# EAGLE design eload_powermeter (EAGLE 9.1.1)
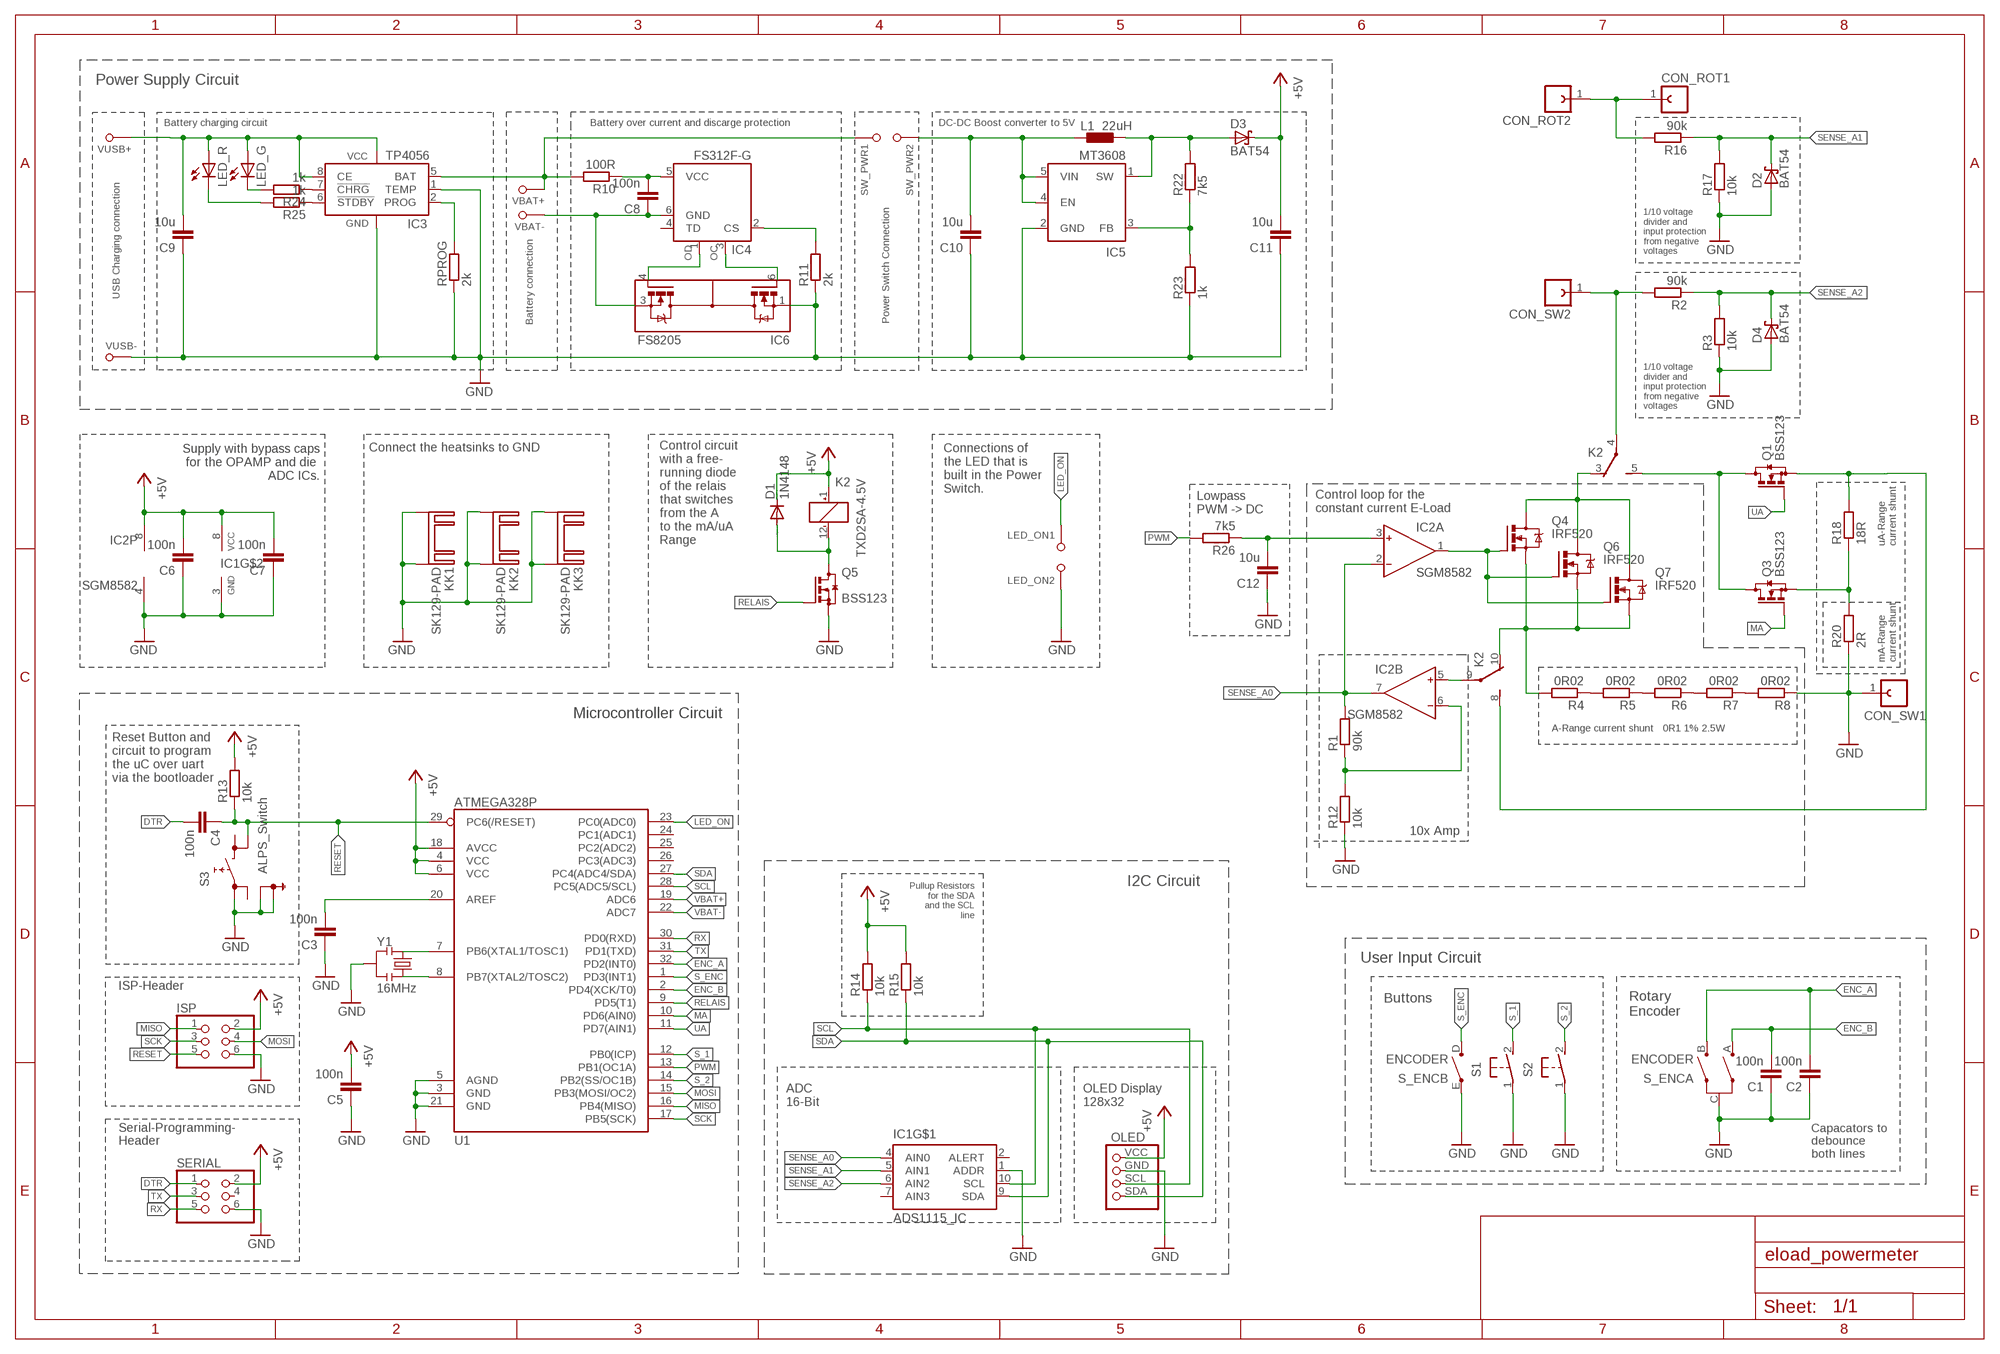
[diagram p0: schematic, sheet 1]

## Parts
C1  100n  C-EUC0603  [C0603]
C2  100n  C-EUC0603  [C0603]
C3  100n  C-EUC0603  [C0603]
C4  100n  C-EUC0603  [C0603]
C5  100n  C-EUC0603  [C0603]
C6  100n  C-EUC0603  [C0603]
C7  100n  C-EUC0603  [C0603]
C8  100n  C-EUC0603  [C0603]
C9  10u  C-EUC0603  [C0603]
C10  10u  C-EUC0603  [C0603]
C11  10u  C-EUC0603  [C0603]
C12  10u  C-EUC0603  [C0603]
CON_ROT1  BANANEN_BUCHSE  [BANANENBUCHSE]
CON_ROT2  BANANEN_BUCHSE  [BANANENBUCHSE]
CON_SW1  BANANEN_BUCHSE  [BANANENBUCHSE]
CON_SW2  BANANEN_BUCHSE  [BANANENBUCHSE]
D1  1N4148  MBR0520LT  [SOD123]
D2  BAT54  [SOT23]
D3  BAT54  [SOT23]
D4  BAT54  [SOT23]
IC1  ADS1115_IC  [MSOP10]
IC2  SGM8582  AD826R  [SO8]
IC3  TP4056  [SOP08]
IC4  FS312F-G  [SOT23-6]
IC5  MT3608  [SOT23-6]
IC6  FS8205  [SOT23-6]
ISP  PINHD-2X3_SMD  [2X03]
K2  TXD2SA-4.5V  [TXD2SA]
KK1  SK129-PAD  [SK129]
KK2  SK129-PAD  [SK129]
KK3  SK129-PAD  [SK129]
L1  22uH  L_1210  [R1210]
LED_G  LED_REVERSE_MOUNTSMT1206_REVERSE  [1206_LED_REVERSE_MOUNT]
LED_ON1  SOLDER_PAD  [SOLDER_PAD]
LED_ON2  SOLDER_PAD  [SOLDER_PAD]
LED_R  LED_REVERSE_MOUNTSMT1206_REVERSE  [1206_LED_REVERSE_MOUNT]
OLED  OLED_128X32  [1X04_OLED]
Q1  BSS123  [SOT23]
Q3  BSS123  [SOT23]
Q4  IRF520  [TO220BV]
Q5  BSS123  [SOT23]
Q6  IRF520  [TO220BV]
Q7  IRF520  [TO220BV]
R1  90k  R-EU_R0603  [R0603]
R2  90k  R-EU_R0603  [R0603]
R3  10k  R-EU_R0603  [R0603]
R4  0R02  R-EU_R1206  [R1206]
R5  0R02  R-EU_R1206  [R1206]
R6  0R02  R-EU_R1206  [R1206]
R7  0R02  R-EU_R1206  [R1206]
R8  0R02  R-EU_R1206  [R1206]
R10  100R  R-EU_R0603  [R0603]
R11  2k  R-EU_R0603  [R0603]
R12  10k  R-EU_R0603  [R0603]
R13  10k  R-EU_R0603  [R0603]
R14  10k  R-EU_R0603  [R0603]
R15  10k  R-EU_R0603  [R0603]
R16  90k  R-EU_R0603  [R0603]
R17  10k  R-EU_R0603  [R0603]
R18  18R  R-EU_R0603  [R0603]
R20  2R  R-EU_R0603  [R0603]
R22  7k5  R-EU_R0603  [R0603]
R23  1k  R-EU_R0603  [R0603]
R24  1k  R-EU_R0603  [R0603]
R25  1k  R-EU_R0603  [R0603]
R26  7k5  R-EU_R0603  [R0603]
RPROG  2k  R-EU_R0603  [R0603]
S1  PUSH_BUTTON_ALPS  [B3F-31XX]
S2  PUSH_BUTTON_ALPS  [B3F-31XX]
S3  ALPS_Switch  ALPS_SKSGPAE010S  [SKHMPXE010]
S_ENC  ENCODER  [CI-11]
SERIAL  PINHD-2X3_SMD  [2X03]
SW_PWR1  SOLDER_PAD  [SOLDER_PAD]
SW_PWR2  SOLDER_PAD  [SOLDER_PAD]
U1  ATMEGA328P  [TQFP32-08]
VBAT+  SOLDER_PAD  [SOLDER_PAD]
VBAT-  SOLDER_PAD  [SOLDER_PAD]
VUSB+  SOLDER_PAD  [SOLDER_PAD]
VUSB-  SOLDER_PAD  [SOLDER_PAD]
Y1  16MHz  RESONATOR1:1  [RESONATOR-SMD-1:1]

## Nets
+5V: C5.2 C6.2 C7.2 C11.2 D1.C D3.3(C) IC1.8(VCC) IC2.8(P:V+) ISP.2 K2.1(_:+) OLED.VCC(VDD) R13.2 R14.2 R15.2 SERIAL.2 U1.4(VCC) U1.6(VCC) U1.18(AVCC)
DTR: C4.2 SERIAL.1
ENC_A: C2.2 S_ENC.B(A:B) U1.32(PD2(INT0))
ENC_B: C1.2 S_ENC.A(A:A) U1.2(PD4(XCK/T0))
GND: C1.1 C2.1 C3.1 C5.1 C6.1 C7.1 C9.1 C10.1 C11.1 C12.1 CON_SW1.1 D2.1(A) D4.1(A) IC1.1(ADDR) IC1.3(GND) IC2.4(P:V-) IC3.1(TEMP) IC3.3(GND) IC5.2(GND) IC6.1(S1) ISP.6 KK1.A2,5(K) KK1.B2,5(K) KK2.A2,5(K) KK2.B2,5(K) KK3.A2,5(K) KK3.B2,5(K) LED_ON2.P$1 OLED.GND Q5.2(S) R3.1 R8.1 R11.1 R12.1 R17.1 R20.1 R23.1 RPROG.1 S1.1(P) S2.1(P) S3.1(3.1) S3.5(SH1) S3.6(SH2) S_ENC.C(A:C) S_ENC.E(B:E) SERIAL.6 U1.3(GND) U1.5(AGND) U1.21(GND) VUSB-.P$1 Y1.2
LED_ON: LED_ON1.P$1 U1.23(PC0(ADC0))
MA: Q3.1(G) U1.10(PD6(AIN0))
MISO: ISP.1 U1.16(PB4(MISO))
MOSI: ISP.4 U1.15(PB3(MOSI/OC2))
N$1: CON_ROT1.1 CON_ROT2.1 R16.2
N$2: IC2.1(A:OUT) Q4.G Q6.G Q7.G
N$3: Q3.2(S) R18.1 R20.2
N$5: K2.5(S) Q1.3(D) Q3.3(D)
N$6: R4.1 R5.2
N$7: K2.10(O) Q4.S Q6.S Q7.S R4.2
N$8: C12.2 IC2.3(A:IN+) R26.1
N$9: K2.3(O) Q4.D Q6.D Q7.D
N$10: D1.A K2.12(_:-) Q5.3(D)
N$11: R5.1 R6.2
N$12: U1.7(PB6(XTAL1/TOSC1)) Y1.1
N$13: IC2.5(B:IN+) K2.9(P)
N$14: CON_SW2.1 K2.4(P) R2.2
N$15: U1.8(PB7(XTAL2/TOSC2)) Y1.3
N$16: C8.2 IC4.5(VCC) R10.1
N$17: R6.1 R7.2
N$18: R7.1 R8.2
N$19: D3.1(A) IC5.1(SW) L1.2 R22.2
N$20: IC4.1(OD) IC6.4(G2)
N$21: IC3.2(PROG) RPROG.2
N$22: IC4.3(OC) IC6.6(G1)
N$23: C10.2 IC5.4(EN) IC5.5(VIN) L1.1 SW_PWR2.P$1
N$24: IC4.2(CS) R11.2
N$25: IC5.3(FB) R22.1 R23.2
N$27: IC3.7(!CHRG) R24.1
N$28: IC3.6(!STDBY) R25.1
N$29: LED_G.C R24.2
N$30: LED_R.C R25.2
N$31: C3.2 U1.20(AREF)
N$33: IC2.6(B:IN-) R1.1 R12.2
N$40: K2.8(S) Q1.2(S) R18.2
PWM: R26.2 U1.13(PB1(OC1A))
RELAIS: Q5.1(G) U1.9(PD5(T1))
RESET: C4.1 ISP.5 R13.1 S3.4(4.2) U1.29(PC6(/RESET))
RX: SERIAL.5 U1.30(PD0(RXD))
S_1: S1.2(S) U1.12(PB0(ICP))
S_2: S2.2(S) U1.14(PB2(SS/OC1B))
S_ENC: S_ENC.D(B:D) U1.1(PD3(INT1))
SCK: ISP.3 U1.17(PB5(SCK))
SCL: IC1.10(SCL) OLED.SCL R14.1 U1.28(PC5(ADC5/SCL))
SDA: IC1.9(SDA) OLED.SDA R15.1 U1.27(PC4(ADC4/SDA))
SENSE_A0: IC1.4(AIN0) IC2.2(A:IN-) IC2.7(B:OUT) R1.2
SENSE_A1: D2.3(C) IC1.5(AIN1) R16.1 R17.2
SENSE_A2: D4.3(C) IC1.6(AIN2) R2.1 R3.2
TX: SERIAL.3 U1.31(PD1(TXD))
UA: Q1.1(G) U1.11(PD7(AIN1))
VBAT+: IC3.5(BAT) R10.2 SW_PWR1.P$1 U1.19(ADC6) VBAT+.P$1
VBAT-: C8.1 IC4.6(GND) IC6.3(S2) U1.22(ADC7) VBAT-.P$1
VUSB: C9.2 IC3.4(VCC) IC3.8(CE) LED_G.A LED_R.A VUSB+.P$1
Unconnected: IC1.2(ALERT) IC1.7(AIN3) IC4.4(TD) IC6.2(D1) IC6.5(D2) S3.2(4.1) S3.3(3.2) SERIAL.4 U1.24(PC1(ADC1)) U1.25(PC2(ADC2)) U1.26(PC3(ADC3))

## Notes on the sheet
- Power Supply Circuit
- Battery charging circuit | Battery over current and discarge protection | DC-DC Boost converter to 5V
- 1/10 voltage
  divider and
  input protection
  from negative
  voltages
- USB Charging connection
- Battery connection | Power Switch Connection
- 1/10 voltage
  divider and
  input protection
  from negative
  voltages
- Supply with bypass caps
  for the OPAMP and die 
  ADC ICs.
- Connect the heatsinks to GND
- Connections of
  the LED that is
  built in the Power
  Switch.
- Control loop for the 
  constant current E-Load
- Lowpass
  PWM -> DC
- Control circuit
  with a free-
  running diode
  of the relais
  that switches
  from the A 
  to the mA/uA
  Range
- uA-Range 
  current shunt
- mA-Range 
  current shunt
- Microcontroller Circuit
- A-Range current shunt   0R1 1% 2.5W
- Reset Button and
  circuit to program
  the uC over uart
  via the bootloader
- 10x Amp
- I2C Circuit
- Pullup Resistors
  for the SDA
  and the SCL
  line
- User Input Circuit
- ISP-Header
- Buttons
- Rotary 
  Encoder
- ADC
  16-Bit
- OLED Display
  128x32
- Serial-Programming-
- Header
- Capacators to 
  debounce 
  both lines

## Library data of the parts
C1-C12 = rcl:C-EU: CAPACITOR, European symbol; SPICEPREFIX: C
CON_ROT1 CON_ROT2 CON_SW1 CON_SW2 = PowerMeter:BANANEN_BUCHSE: FEMALE HEADER
D1 = diode:MBR0520LT: SCHOTTKY BARRIER RECTIFIER Source: http://onsemi.com .. MBR0520LT1-D.pdf
D2-D4 = diode:BAT54: Schottky Diodes Source: Fairchild .. BAT54.pdf
IC1 = eload_powermeter:ADS1115_IC: edit this description Auto generated by make-symbol-device-package-bsdl.ulp Rev. 44 Source:
IC2 = analog-devices:AD826: High-Speed, Low-Power Dual Operational Amplifier Source: http://www.analog.com/static/imported-files/data_sheets/AD826.pdf; MF: ALTERA CORPORATION; MPN: AD826AR; OC_FARNELL: 1651291; OC_NEWARK: 05F7688
IC3 = eload_powermeter:TP4056: edit this description Auto generated by make-symbol-device-package-bsdl.ulp Rev. 44 Source:
IC4 = eload_powermeter:FS312F-G: edit this description Auto generated by make-symbol-device-package-bsdl.ulp Rev. 44 Source:
IC5 = eload_powermeter:MT3608: 90% EFFICIENT SYNCHRONOUS BOOST CONVERTER WITH 600-mA SWITCH Source: http://focus.ti.com/lit/ds/symlink/tps61070.pdf
IC6 = eload_powermeter:FS8205
ISP SERIAL = eload_powermeter:PINHD-2X3_SMD: PIN HEADER
K2 = relay:TX?-*: TX Relais NAiS TX-D RELAYS HIGH INSULATION Conforming to the supplementary insulation class of EN Standards (EN41003) Source: http://www.mew-europe.com/.. en_ds_61022_0007.pdf TX-S RELAYS SMALL POLARIZED RELAY WITH HIGH SENSITIVITY 50mW Source: http://www.mew-europe.com/.. en_ds_61022_0022.pdf; MPN: TXD2SA-4.5V; OC_FARNELL: unknown; OC_NEWARK: 13P9531
KK1-KK3 = eload_powermeter:SK129-PAD: HEATSINK manufacturer Fischer/distributor Buerklin
L1 = eload_powermeter:L_1210
LED_G LED_R = eload_powermeter:LED_REVERSE_MOUNT: LED OSRAM: - CHIPLED LG R971, LG N971, LY N971, LG Q971, LY Q971, LO R971, LY R971 LH N974, LH R974 LS Q976, LO Q976, LY Q976 LO Q996 - Hyper CHIPLED LW Q18S LB Q993, LB Q99A, LB R99A - SideLED LS A670, LO A670, LY A670, LG A670, LP A670 LB A673, LV A673, LT A673, LW A673 LH A674 LY A675 LS A676, LA A676, LO A676, LY A676, LW A676 LS A679, LY A679, LG A679 - Hyper Micro SIDELED® LS Y876, LA Y876, LO Y876, LY Y876 LT Y87S - SmartLED LW L88C, LW L88S LB L89C, LB L89S, LG L890 LS L89K, LO L89K, LY L89K LS L896, LA L896, LO L896, LY L896 - TOPLED LS T670, LO T670, LY T670, LG T670, LP T670 LSG T670, LSP T670, LSY T670, LOP T670, LYG T670 LG T671, LOG T671, LSG T671 LB T673, LV T673, LT T673, LW T673 LH T674 LS T676, LA T676, LO T676, LY T676, LB T676, LH T676, LSB T676, LW T676 LB T67C, LV T67C, LT T67C, LS T67K, LO T67K, LY T67K, LW E67C LS E67B, LA E67B, LO E67B, LY E67B, LB E67C, LV E67C, LT E67C LW T67C LS T679, LY T679, LG T679 LS T770, LO T770, LY T770, LG T770, LP T770 LB T773, LV T773, LT T773, LW T773 LH T774 LS E675, LA E675, LY E675, LS T675 LS T776, LA T776, LO T776, LY T776, LB T776 LHGB T686 LT T68C, LB T68C - Hyper Mini TOPLED® LB M676 - Mini TOPLED Santana® LG M470 LS M47K, LO M47K, LY M47K Source: http://www.osram.convergy.de LUXEON: - LUMILED® LXK2-PW12-R00, LXK2-PW12-S00, LXK2-PW14-U00, LXK2-PW14-V00 LXK2-PM12-R00, LXK2-PM12-S00, LXK2-PM14-U00 LXK2-PE12-Q00, LXK2-PE12-R00, LXK2-PE12-S00, LXK2-PE14-T00, LXK2-PE14-U00 LXK2-PB12-K00, LXK2-PB12-L00, LXK2-PB12-M00, LXK2-PB14-N00, LXK2-PB14-P00, LXK2-PB14-Q00 LXK2-PR12-L00, LXK2-PR12-M00, LXK2-PR14-Q00, LXK2-PR14-R00 LXK2-PD12-Q00, LXK2-PD12-R00, LXK2-PD12-S00 LXK2-PH12-R00, LXK2-PH12-S00 LXK2-PL12-P00, LXK2-PL12-Q00, LXK2-PL12-R00 Source: www.luxeon.com KINGBRIGHT: KA-3528ASYC Source: www.kingbright.com
LED_ON1 LED_ON2 SW_PWR1 SW_PWR2 VBAT+ VBAT- VUSB+ VUSB- = eload_powermeter:SOLDER_PAD
OLED = eload_powermeter:OLED_128X32: PIN HEADER
Q1 Q3 Q5 = transistor-small-signal:BSS123: N-CHANNEL MOS FET
Q4 Q6 Q7 = transistor-power:IRF520: HEXFET Power MOSFET
R1-R8 R10-R18 R20 R22-R26 RPROG = rcl:R-EU_: RESISTOR, European symbol; SPICEPREFIX: R
S1 S2 = eload_powermeter:PUSH_BUTTON_ALPS: OMRON SWITCH; MPN: B3F-3100; OC_FARNELL: 959704; OC_NEWARK: 36M3582
S3 = eload_powermeter:ALPS_SKSGPAE010: 6.2 X 6.5mm TACT Switch (SMD) Source: http://www3.alps.co.jp/WebObjects/catalog.woa/PDF/E/Switch/Tact/SKHM/SKHM.PDF
S_ENC = eload_powermeter:ENCODER: 11mm Incemental Encoder Source: www.piher.net .. 04-CI-11v04.pdf; OC_FARNELL: unknown; OC_NEWARK: unknown
U1 = eload_powermeter:ATMEGA328P
Y1 = eload_powermeter:RESONATOR: Resonator Small SMD resonator. This is the itty bitty 10/20MHz resonators with built in caps. CSTCE10M0G55 and CSTCE20M0V53. Footprint for SMD has been used in SFE production for years, and does work okay. 1:1 is an attempt to get larger fillets on the sides so it will be easier to inspect these solders in our AOI machine. The pads have been minimized to match the actual metal under the resonator. To see this relation, it includes an image import of the bottom side of the component. Imported to scale on layer 200.

## Module TEST
Ports: 

### Library data of the parts

## Board
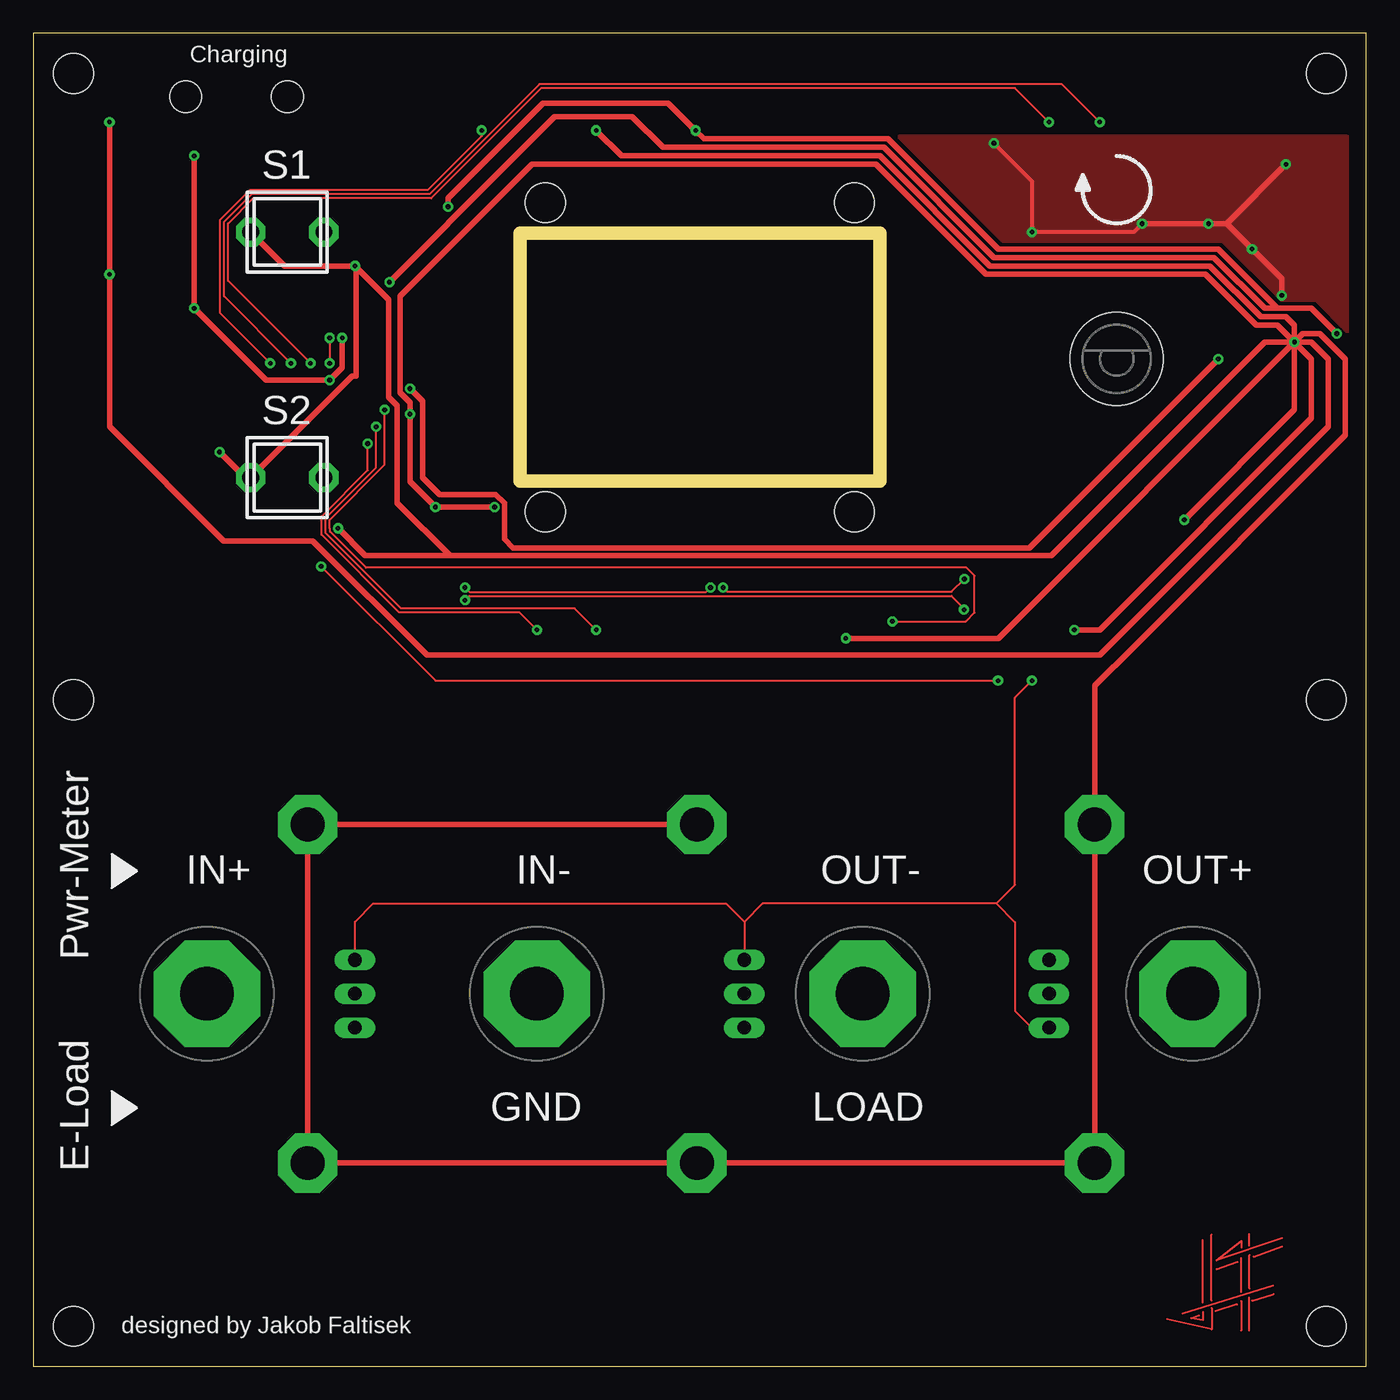
[diagram p1: board, top side]
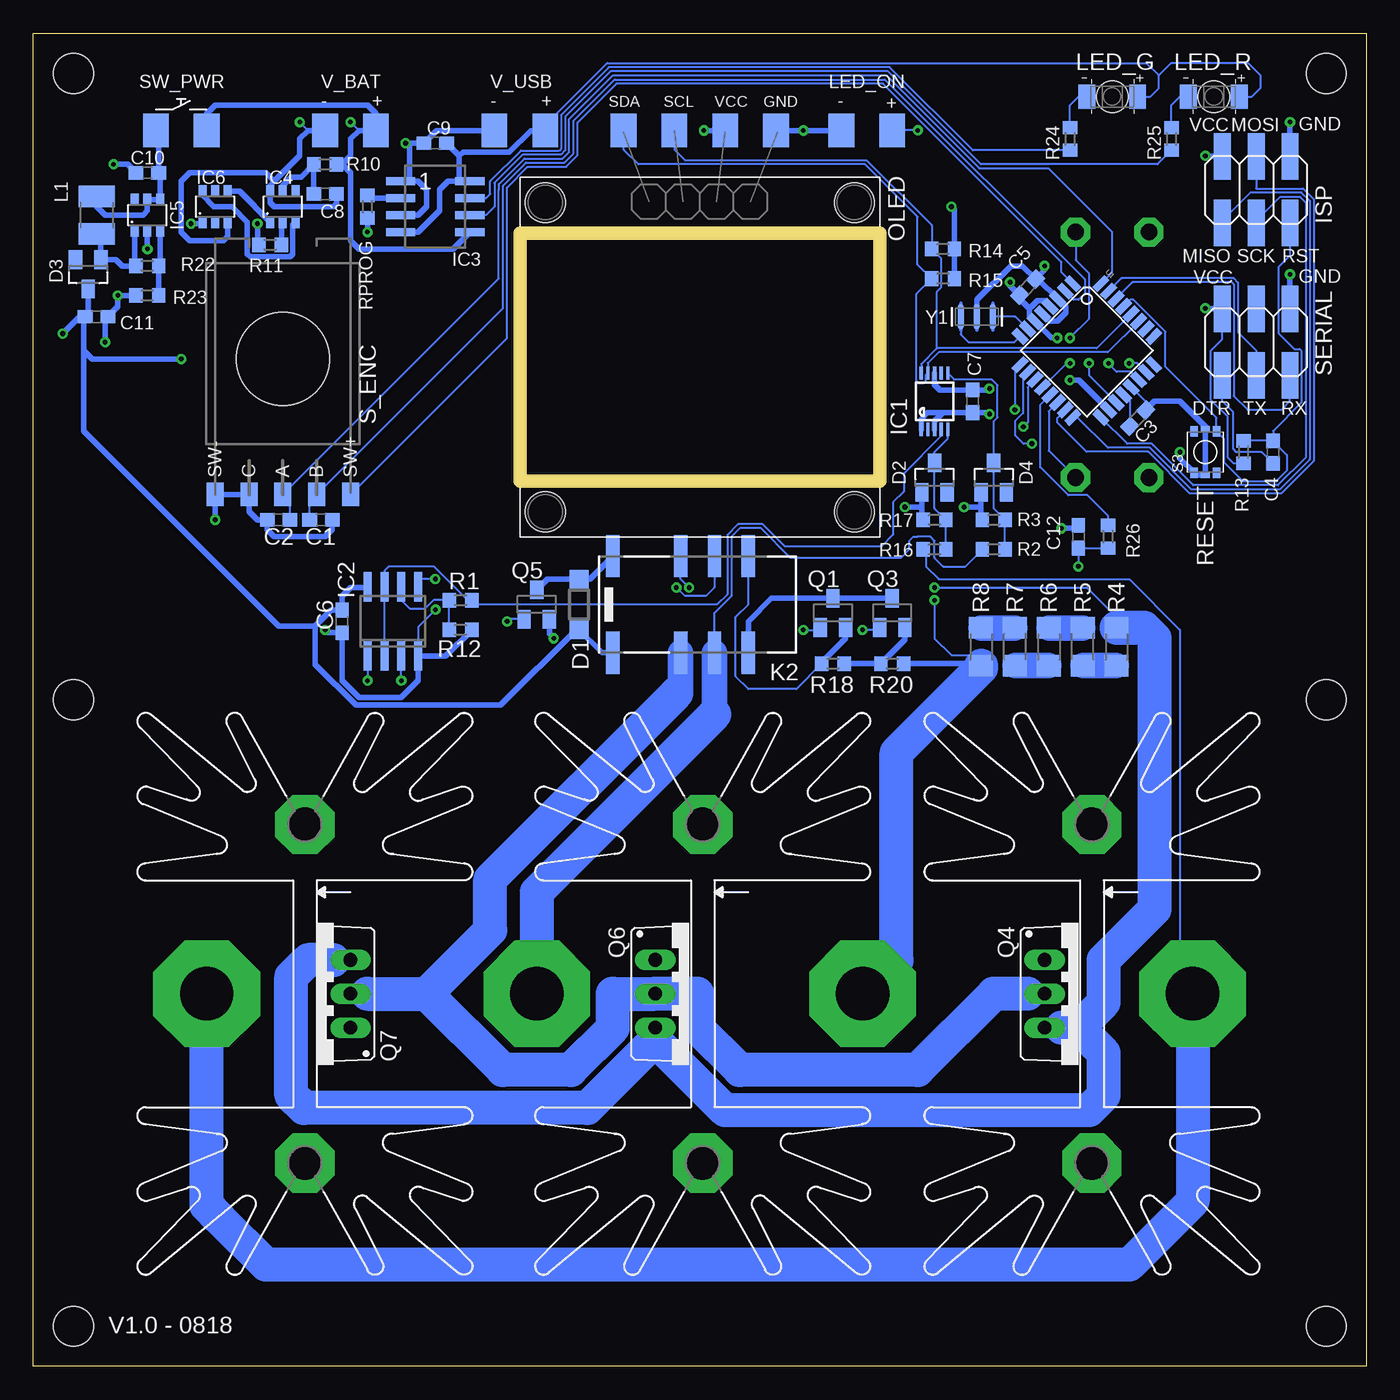
[diagram p2: board, bottom side, seen from below]

Size 100 x 100 mm. Coordinates in mm from the lower left corner, seen from the top.
Outline: 0,0 100,0 100,100 0,100 0,0
Copper layers (1*16): Top 0.035mm / dielectric 1.5mm / Bottom 0.035mm
Design rules "default": minimum track width 6mil, minimum drill 0.35mm, track to track 6mil, track to pad 6mil, pad to pad 6mil, via to via 6mil, smd to smd 6mil, copper to edge 40mil, drill to drill 6mil, minimum pad ring 10mil, minimum via ring 8mil, stop-mask expansion 4mil, vias tented up to drill 0mil, thermal gap 10mil
Holes 3 mm at 3,97 3,3 97,3 97,50 3,50 97,97

### Footprints (pad centres in the part's own frame; a part is rotated, then mirrored left to right if it is on the bottom)
C0603 = smd 1.1 x 1: 1 -0.85,0; 2 0.85,0
BANANENBUCHSE = drill 4 pad 8 octagon: 1 0,0
SOD123 = smd 1.4 x 1.4: A 1.9,0; C -1.9,0
SOT23 = smd 1 x 1.4: 1 -0.95,-1.1; 2 0.95,-1.1; 3 0,1.1
MSOP10 = smd 0.25 x 1: 1 -1,-2.113; 2 -0.5,-2.113; 3 0,-2.113; 4 0.5,-2.113; 5 1,-2.113; 6 1,2.113; 7 0.5,2.113; 8 0,2.113; 9 -0.5,2.113; 10 -1,2.113
SO8 = smd 0.6 x 2.2: 1 -1.905,-2.6; 2 -0.635,-2.6; 3 0.635,-2.6; 4 1.905,-2.6; 5 1.905,2.6; 6 0.635,2.6; 7 -0.635,2.6; 8 -1.905,2.6
SOP08 = smd 0.6 x 2.2: 1 -1.905,-2.6; 2 -0.635,-2.6; 3 0.635,-2.6; 4 1.905,-2.6; 5 1.905,2.6; 6 0.635,2.6; 7 -0.635,2.6; 8 -1.905,2.6
SOT23-6 = smd 0.6 x 0.9: 1 -0.95,-1.15; 2 0,-1.15; 3 0.95,-1.15; 4 0.95,1.15; 5 0,1.15; 6 -0.95,1.15
2X03 = smd 1.27 x 3.5: 1 -2.54,-2.5; 2 -2.54,2.5; 3 0,-2.5; 4 0,2.5; 5 2.54,-2.5; 6 2.54,2.5
TXD2SA = smd 1 x 3.16: 1 -6.35,-3.62; 3 -1.27,-3.62; 4 1.27,-3.62; 5 3.81,-3.62; 8 3.81,3.62; 9 1.27,3.62; 10 -1.27,3.62; 12 -6.35,3.62
SK129 = drill 2.54 pad 4.445 octagon: A2,5 -12.7,-0.889; B2,5 12.7,-0.889
R1210 = smd 1.6 x 2.7: 1 -1.4,0; 2 1.4,0
1206_LED_REVERSE_MOUNT = smd 1.27 x 1.803: A -1.9,0; C 1.9,0 | hole 2.4: 0,0
SOLDER_PAD = smd 1.93 x 2.54: P$1 0,0
1X04_OLED = smd 1.93 x 2.54 bottom: GND -5.715,16.51; SCL 1.905,16.51; SDA 5.715,16.51; VCC -1.905,16.51 | hole 3: -11.6,11.1; 11.6,11.1; 11.6,-12.1; -11.6,-12.1
TO220BV = drill 1.016 long: D 0,-2.54; G -2.54,-2.54; S 2.54,-2.54
R0603 = smd 1 x 1.1: 1 -0.85,0; 2 0.85,0
R1206 = smd 1.6 x 1.803: 1 -1.422,0; 2 1.422,0
B3F-31XX = drill 1.25 pad 2.184 octagon: 1 -2.75,0; 2 2.75,0
SKHMPXE010 = smd 0.8 x 0.575: 1 -1.55,0.838; 2 -1.55,-0.838; 3 1.55,0.838; 4 1.55,-0.838 | smd 0.485 x 0.7: 5 1.712,0; 6 -1.712,0
CI-11 = smd 1.27 x 1.778 bottom: A -2.54,-10.16; B 0,-10.16; C 2.54,-10.16; D -5.08,-10.16; E 5.08,-10.16 | hole 7: 0,0
TQFP32-08 = smd 1.27 x 0.559: 1 -4.293,2.8; 2 -4.293,2; 3 -4.293,1.2; 4 -4.293,0.4; 5 -4.293,-0.4; 6 -4.293,-1.2; 7 -4.293,-2; 8 -4.293,-2.8; 17 4.293,-2.8; 18 4.293,-2; 19 4.293,-1.2; 20 4.293,-0.4; 21 4.293,0.4; 22 4.293,1.2; 23 4.293,2; 24 4.293,2.8 | smd 0.559 x 1.27: 9 -2.8,-4.293; 10 -2,-4.293; 11 -1.2,-4.293; 12 -0.4,-4.293; 13 0.4,-4.293; 14 1.2,-4.293; 15 2,-4.293; 16 2.8,-4.293; 25 2.8,4.293; 26 2,4.293; 27 1.2,4.293; 28 0.4,4.293; 29 -0.4,4.293; 30 -1.2,4.293; 31 -2,4.293; 32 -2.8,4.293
RESONATOR-SMD-1:1 = smd 0.45 x 1.905: 1 -1.2,0; 2 0,0; 3 1.2,0

### Placement (x,y rotation side)
C1  78.42,63.5 180 bottom
C2  81.6,63.5 0 bottom
C3  17.14,71.12 225 bottom
C4  6.99,68.58 270 bottom
C5  25.4,80.96 225 bottom
C6  76.83,55.88 90 bottom
C7  29.53,72.39 90 bottom
C8  78.11,87.95 180 bottom
C9  69.85,91.76 0 bottom
C10  91.44,89.53 0 bottom
C11  95.25,78.74 180 bottom
C12  21.59,62.23 270 bottom
CON_ROT1  13.02,27.94 0 top
CON_ROT2  87,27.94 0 top
CON_SW1  37.78,27.94 0 top
CON_SW2  62.23,27.94 0 top
D1  59.05,57.15 90 bottom
D2  32.38,66.67 0 bottom
D3  95.89,81.92 180 bottom
D4  27.94,66.67 0 bottom
IC1  32.38,72.39 0 bottom
IC2  73.03,55.88 0 bottom
IC3  69.85,87 270 bottom
IC4  81.28,87 0 bottom
IC5  91.44,86.36 0 bottom
IC6  86.36,87 0 bottom
ISP  8.26,88.27 0 bottom
K2  50.16,57.15 0 bottom
KK1  48.9,27.94 270 bottom
KK2  78.74,27.94 270 bottom
KK3  19.68,27.94 270 bottom
L1  95.25,86.36 270 bottom
LED_G  19.05,95.25 180 bottom
LED_ON1  35.56,92.71 180 bottom
LED_ON2  39.37,92.71 180 bottom
LED_R  11.43,95.25 180 bottom
OLED  50,76.2 0 top
Q1  40.01,56.52 0 bottom
Q3  35.56,56.52 0 bottom
Q4  21.59,27.94 270 bottom
Q5  62.23,57.15 0 bottom
Q6  50.8,27.94 270 bottom
Q7  78.74,27.94 90 bottom
R1  67.94,57.47 0 bottom
R2  27.94,61.28 180 bottom
R3  27.94,63.5 0 bottom
R4  18.73,53.98 90 bottom
R5  21.27,53.98 270 bottom
R6  23.81,53.98 90 bottom
R7  26.35,53.98 270 bottom
R8  28.89,53.98 90 bottom
R10  78.11,90.17 0 bottom
R11  82.23,84.14 0 bottom
R12  67.94,55.24 180 bottom
R13  9.21,68.58 270 bottom
R14  31.75,83.82 0 bottom
R15  31.75,81.6 0 bottom
R16  32.38,61.28 180 bottom
R17  32.38,63.5 0 bottom
R18  40.01,52.7 180 bottom
R20  35.56,52.7 180 bottom
R22  91.44,82.55 180 bottom
R23  91.44,80.33 0 bottom
R24  22.23,92.08 90 bottom
R25  14.61,92.08 90 bottom
R26  19.37,62.23 90 bottom
RPROG  74.93,87 90 bottom
S1  19.05,85.09 0 top
S2  19.05,66.67 0 top
S3  12.06,68.58 90 bottom
S_ENC  81.28,75.56 0 top
SERIAL  8.26,76.83 0 bottom
SW_PWR1  87,92.71 0 bottom
SW_PWR2  90.81,92.71 0 bottom
U1  20.95,76.2 315 bottom
VBAT+  74.3,92.71 0 bottom
VBAT-  78.11,92.71 0 bottom
VUSB+  61.59,92.71 0 bottom
VUSB-  65.41,92.71 0 bottom
Y1  29.21,78.74 180 bottom

### Tracks (layer width: path | path; a pad name or v marks a point on that pad's centre or on a via)
+5V  (via drill 0.35)
  Top 0.406: v26.72,81.33 31.11,85.72 31.11,85.77 39.11,93.76 44.91,93.76 47.23,91.44 63.82,91.44 72.07,83.19 88.58,83.19 92.39,79.38 93.34,79.38 | v88.9,75.56 74.72,61.38 36,61.38 35.34,62.04 35.34,64.76 34.69,65.41 30.48,65.41 29.21,66.67 29.21,72.39 v28.26,73.34 | v23.18,77.15 23.18,74.93 v22.23,73.98 17.46,73.98 v12.06,79.38 v12.06,90.81 | v31.11,87 31.11,87.63 38.26,94.77 47.62,94.77 v49.69,92.71 50.32,92.08 64.14,92.08 72.39,83.82 88.9,83.82 93.34,79.38 | v97.79,77.47 95.89,79.38 93.34,79.38
  Bottom 0.152: D1.C | SERIAL.2 10.79,77.04 11.66,76.18 11.66,72.49 10.39,71.23 10.39,68.18 9.95,67.73 R13.2 | 21.56,73.98 21.59,73.98
  Bottom 0.406: D3.3 95.89,78.95 C11.2 | IC2.8 74.99,58.42 76.2,58.42 76.83,57.78 C6.2 77.66,56.73 78.84,55.55 | K2.1 57.34,53.53 D1.C | D1.C 59.28,55.25 64.93,49.61 75.8,49.61 78.84,52.65 78.84,55.55 | 78.84,55.55 81.58,55.55 96.2,70.17 96.2,76.2 | 96.2,76.2 96.2,78.64 C11.2 | U1.4 24.14,79.95 24.67,79.95 25.27,79.35 | 25.27,79.35 25.27,78.82 U1.6 23.61,77.15 v23.18,77.15 | 25.27,79.35 26,80.08 C5.2 26.72,81.08 v26.72,81.33 | IC1.8 32.38,73.66 31.96,73.24 C7.2 28.26,73.24 v28.26,73.34 | R15.2 R14.2 30.9,86.78 v31.11,87 | 96.2,76.2 95.57,75.56 v88.9,75.56 | U1.18 21.56,73.98 | SERIAL.2 12.03,79.33 v12.06,79.38 | ISP.2 12.03,90.77 v12.06,90.81 | v97.79,77.47 96.52,78.74 C11.2 | 21.59,73.98 v22.23,73.98 | OLED.VCC v49.69,92.71
DTR
  Bottom 0.152: 9.73,68.58 7.83,68.58 C4.2 | 9.73,68.58 | 9.73,68.58 9.99,68.83 9.99,71.58 10.79,72.39 SERIAL.1
ENC_A
  Bottom 0.152: C2.2 80.75,64.87 S_ENC.B 65.09,81.6 65.09,88.27 65.08,88.28 65.08,88.69 63.16,90.6 60.28,90.6 59.79,91.09 59.79,93.56 56.52,96.84 35.99,96.84 29.02,89.86 23.82,89.86 19.05,85.09 19.05,82.06 U1.32
ENC_B
  Bottom 0.152: C1.2 79.27,64.87 S_ENC.A 64.77,79.38 64.77,88.56 63.03,90.3 60.16,90.3 59.49,90.97 59.49,93.44 56.39,96.53 36.12,96.53 21.12,81.54 21.12,80.48 21.59,80.01 21.94,80.01 U1.2
GND  (via drill 0.35)
  Top 0.152: KK3.A2,5 20.95,40.64 20.57,40.26 | v32.38,57.47 32.7,57.78 68.9,57.78 69.83,56.86 v69.83,56.76
  Top 0.305: v72.07,91.76 74.93,88.9 v74.93,85.09 82.55,85.09 v83.19,85.72
  Top 0.406: v83.19,85.72 v88.17,85.72 89.53,85.72 | v93.98,90.17 89.53,85.72 | v93.66,80.33 93.66,81.6 v91.44,83.82 89.53,85.72 | v86.36,63.5 94.61,71.75 v94.61,76.83 | v94.61,76.83 72.39,54.61 v60.96,54.61 | v78.11,55.24 80.01,55.24 95.89,71.12 95.89,75.56 v94.61,76.83 | 20.95,40.64 KK1.A2,5 | 20.57,40.26 KK3.B2,5 KK1.B2,5 KK2.B2,5 KK2.A2,5 79.63,51.05 82.55,53.98 98.42,69.85 98.42,75.56 96.52,77.47 95.25,77.47 v94.61,76.83 | v42.23,92.71 44.13,90.81 63.5,90.81 71.75,82.55 88.27,82.55 92.08,78.74 93.98,78.74 94.61,78.11 v94.61,76.83 | v5.71,93.34 v5.71,81.92 5.71,70.48 14.29,61.91 20.95,61.91 29.53,53.34 80.01,53.34 97.16,70.48 97.16,75.56 95.89,76.83 v94.61,76.83 | S1.1 18.84,82.55 v24.13,82.55 | 31.25,60.82 76.38,60.82 92.39,76.83 v94.61,76.83 | v24.13,82.55 24.21,82.47 24.21,74.3 23.92,74.3 S2.1 15.88,66.67 v13.97,68.58 | v22.86,62.87 24.9,60.82 31.25,60.82 | 31.25,60.82 27.3,64.77 27.3,72.07 26.67,72.71 26.67,80.01 v24.13,82.55 | v94.61,76.83 93.34,78.11 91.76,78.11 87.95,81.92 71.47,81.92 63.21,90.17 37.42,90.17 27.52,80.27 27.52,73.04 28.26,72.31 v28.26,71.44 28.26,66.36 v30.16,64.45 v34.61,64.45
  Bottom 0.152: C3.1 16.54,71.75 16.54,72.36 U1.21 | 28.89,52.39 28.57,52.7 28.57,53.34 31.11,53.34 32.38,54.61 v32.38,57.47 | v69.83,56.76 71.12,55.47 IC2.4 | 28.89,63.6 R3.1
  Bottom 0.406: IC6.1 87.43,85.72 v88.17,85.72 | v83.19,85.72 83.19,84.24 R11.1 | R23.1 v93.66,80.33 93.66,79.48 C11.1 94.61,78.53 v94.61,76.83 | C10.1 92.92,90.17 v93.98,90.17 | RPROG.1 v74.93,85.09 | VUSB-.P$1 69.75,92.71 C9.1 v72.07,91.76 71.75,91.44 71.75,88.9 IC3.1 71.12,88.9 70.48,88.27 70.48,87 71.12,86.36 IC3.3 | v86.36,63.5 S_ENC.E S_ENC.C 83.82,64.14 83.19,63.5 C2.1 82.45,62.76 81.92,62.23 78.11,62.23 77.57,62.76 C1.1 | v60.96,54.61 61.28,54.93 Q5.2 | v78.11,55.24 77.89,55.03 C6.1 76.83,51.44 75.56,50.16 72.39,50.16 71.12,51.44 IC2.4 69.06,53.28 R12.1 | C5.1 24.62,81.56 U1.3 22.54,79.48 22.54,79.06 23.18,78.42 23.74,78.42 U1.5 | C5.1 25.79,82.55 26.67,82.55 29.21,80.01 Y1.2 | 31.75,71.54 C7.1 28.36,71.54 v28.26,71.44 | 31.75,71.54 32.92,71.54 33.38,71.07 IC1.1 | OLED.GND v42.23,92.71 LED_ON2.P$1 | C5.1 24.13,82.23 v24.13,82.55 | SERIAL.6 v5.71,81.92 | v5.71,93.34 ISP.6 | 16.54,71.75 15.91,72.39 13.97,72.39 11.97,70.39 S3.5 S3.6 12.74,66.87 S3.1 13.97,68.1 v13.97,68.58 | v22.86,62.87 21.8,62.87 C12.1 | R20.1 29.21,52.7 28.89,52.39 | D4.1 28.89,64.45 | 28.89,64.45 28.89,63.6 | v30.16,64.45 28.89,64.45 | D2.1 33.34,64.45 | 33.34,64.45 33.34,63.6 R17.1 | v34.61,64.45 33.34,64.45 | IC5.2 v91.44,83.82 | IC1.3 32.38,70.91 31.75,71.54
  Bottom 2.54: CON_SW1.1 35.24,30.48 35.24,46.04 28.89,52.39 R8.1
  pour Top: 64.93,92.23 72.71,84.45 89.22,84.45 93.66,80.01 96.2,80.01 98.58,77.63 98.58,92.23
LED_ON  (via drill 0.35)
  Top 0.152: v33.65,92.72 33.65,92.29 29.62,88.27 16.28,88.27 13.99,85.98 13.99,79.03 v17.78,75.25
  Bottom 0.152: v33.65,92.72 LED_ON1.P$1 | U1.23 17.17,75.25 v17.78,75.25
MA  (via drill 0.35)
  Top 0.152: v37.78,55.24 36.47,56.56 27.45,56.56 21.61,62.39 21.61,63.75 25.08,67.22 v25.08,69.22
  Bottom 0.152: Q3.1 36.68,55.24 v37.78,55.24 | v25.08,69.22 25.72,69.22 26.35,69.85 26.35,70.9 25.75,71.5 25.75,74.24 U1.10
MISO
  Bottom 0.152: U1.16 21.66,71.19 19.38,68.91 16.23,68.91 13.1,65.79 6.49,65.79 4.24,68.03 4.24,87.43 4.86,88.05 8.68,88.05 10.79,85.93 | 10.79,85.93 ISP.1 10.79,85.93
MOSI
  Bottom 0.152: ISP.4 8.26,88.35 4.73,88.35 3.94,87.56 3.94,67.91 6.36,65.48 13.23,65.48 16.35,68.61 20.98,68.61 23.18,70.8 23.18,71.15 U1.15
N$1
  Bottom 0.152: R16.2 33.02,61.06 33.02,60.01 32.07,59.05 17.78,59.05 13.97,55.24 13.97,30.48 13.34,29.84 13.34,28.26 CON_ROT1.1
  Bottom 2.54: CON_ROT1.1 13.02,12.38 17.78,7.62 82.55,7.62 86.04,11.11 87,12.06 CON_ROT2.1
N$2  (via drill 0.35)
  Top 0.152: Q7.G 74.93,25.4 73.66,26.67 73.66,33.31 72.26,34.71 | 72.26,34.71 73.66,36.11 73.66,50.16 v74.93,51.44 | Q4.G 24.13,33.34 25.5,34.71 51.97,34.71 53.34,33.34 | 72.26,34.71 54.71,34.71 53.34,33.34 | 53.34,33.34 Q6.G
  Bottom 0.152: IC2.1 v74.93,51.44
N$3
  Bottom 0.406: R18.1 R20.2 34.61,54.51 34.61,54.61 Q3.2
N$4
  Top 0.152: 87.71,9.46 87.71,4.78
N$5
  Bottom 0.406: Q3.3 Q1.3 44.62,57.62 46.35,55.88 K2.5
N$6
  Bottom 1.905: R5.2 R4.1
N$7  (via drill 0.35)
  Top 0.152: v50.8,58.42 50.47,58.09 32.72,58.09 v32.38,58.42
  Bottom 0.152: v32.38,58.42 20.95,58.42 18.73,56.2 R4.2 | v50.8,58.42 51.44,59.05 K2.10
  Bottom 1.27: Q7.S 77.47,30.48 | Q4.S 22.86,25.4 | Q6.S 53.34,24.45
  Bottom 2.54: R4.2 16.66,55.4 15.88,54.61 15.88,34.29 19.68,30.48 19.68,27.3 21.59,25.4 | 21.59,25.4 19.68,23.5 19.68,20.32 20.8,19.2 48.09,19.2 53.34,24.45 58.42,19.37 79.69,19.37 80.64,20.32 80.64,29.21 79.38,30.48 77.47,30.48 | 22.86,25.4 21.59,25.4
N$8  (via drill 0.35)
  Top 0.152: v21.59,60.01 30.16,51.44 v72.39,51.44
  Bottom 0.152: R26.1 C12.2 v21.59,60.01 | v72.39,51.44 IC2.3
N$9
  Bottom 1.27: Q7.D 74.93,27.94 | Q4.D 25.4,27.94
  Bottom 1.905: K2.3 51.44,50.8 51.75,50.48
  Bottom 2.54: 70.48,27.94 64.77,22.23 59.69,22.23 56.52,25.4 56.52,27.94 Q6.D 50.19,27.94 50.19,25.43 46.99,22.23 33.66,22.23 27.94,27.94 25.4,27.94 | 51.75,50.48 65.72,36.51 65.72,32.7 70.48,27.94 | 74.93,27.94 70.48,27.94
N$10
  Bottom 0.406: K2.12 58.23,59.05 D1.A 61.43,59.05 Q5.3
N$11
  Bottom 1.905: R6.2 R5.1
N$12
  Bottom 0.152: U1.7 26.32,78.74 Y1.1
N$13  (via drill 0.35)
  Top 0.152: v51.75,58.42 52.07,58.1 68.9,58.1 v69.85,59.05
  Bottom 0.152: IC2.5 71.12,59.05 v69.85,59.05 | K2.9 48.9,58.42 49.53,57.78 51.12,57.78 v51.75,58.42
N$14
  Bottom 0.152: R2.2 30.06,60.01 31.75,60.01 32.38,60.64 32.38,61.91 32.7,62.23 33.66,62.23 33.97,62.23 34.29,61.91 34.29,61.28 34.92,60.64 43.18,60.64 45.4,62.87 46.99,62.87 47.62,62.23 47.62,57.78 48.9,56.52 48.9,52.07
  Bottom 1.905: K2.4 48.9,52.07 48.9,48.9
  Bottom 2.54: 48.9,48.9 62.23,35.56 CON_SW2.1
N$15
  Bottom 0.152: Y1.3 30.41,77.4 29.84,76.83 26.39,76.83 U1.8
N$16
  Bottom 0.406: C8.2 R10.1 79.91,89.22 80.64,89.22 81.28,88.58 IC4.5
N$17
  Bottom 1.905: R7.2 R6.1
N$18
  Bottom 1.905: R8.2 R7.1
N$19
  Bottom 0.406: IC5.1 92.39,82.65 | 92.39,82.65 R22.2 | 92.39,82.65 92.49,82.55 93.34,82.55 93.81,83.02 D3.1 94.94,84.64 L1.2
N$20
  Bottom 0.406: IC4.1 84.53,88.14 IC6.4
N$21
  Bottom 0.406: RPROG.2 74.72,87.63 IC3.2
N$22
  Bottom 0.406: IC4.3 80.53,85.65 80.53,83.44 80.73,83.23 83.73,83.23 83.94,83.44 83.94,85.84 85.09,87 86.46,87 87.31,87.84 IC6.6
N$23
  Bottom 0.406: SW_PWR2.P$1 90.59,92.5 C10.2 90.49,89.44 IC5.4 IC5.5 91.44,86.68 91.76,86.36 94.61,86.36 95.25,87 L1.1
N$24
  Bottom 0.406: IC4.2 81.38,85.74 R11.2
N$25
  Bottom 0.406: IC5.3 90.49,82.65 R22.1 R23.2
N$26
  Top 0.152: 87.75,4.07 87.75,3.45 86.88,3.61 87.45,3.81
N$27
  Bottom 0.152: R24.1 29.52,91.22 35.75,97.46 56.81,97.46 60.4,93.87 60.4,91.34 60.53,91.21 63.41,91.21 65.72,88.9 65.72,87.95 66.04,87.63 IC3.7
N$28
  Bottom 0.152: R25.1 15.66,90.17 28.89,90.17 35.88,97.16 56.69,97.16 60.1,93.75 60.1,91.22 60.41,90.91 63.28,90.91 65.41,88.79 65.41,87 66.04,86.36 IC3.6
N$29
  Bottom 0.152: R24.2 22.23,94.61 21.59,95.25 LED_G.C
N$30
  Bottom 0.152: R25.2 14.61,94.61 13.97,95.25 | 13.97,95.25 13.72,95.25 13.97,95.25 | LED_R.C 13.97,95.25
N$31
  Bottom 0.152: U1.20 17.75,72.42 C3.2
N$32
  Top 0.152: 86.24,3.97 93.03,6.05
N$33
  Bottom 0.152: R12.2 R1.1 69.98,57.47 70.6,56.85 71.74,56.85 71.75,56.83 72.39,57.47 IC2.6
N$34
  Top 0.152: 91.44,4.92 93.05,5.4
N$35
  Top 0.152: 91.24,5.83 91.24,8.33
N$36
  Top 0.152: 90.63,5.58 90.63,8.12
N$37
  Top 0.152: 91.56,8.21 93.7,8.99
N$38
  Top 0.152: 93.68,9.6 88.76,7.94 90.65,9.41 90.65,8.91
N$39
  Top 0.152: 91.2,9.92 91.2,9.07
N$40
  Bottom 0.152: R18.2 42.76,50.8 46.35,50.8 47.31,51.75 47.31,56.2 46.35,57.15 K2.8
  Bottom 0.406: Q1.2 39.05,54.61 40.85,52.81 R18.2
N$41
  Top 0.152: 88.76,7.28 90.35,7.82
N$42
  Top 0.152: 91.2,5.16 91.2,2.68
N$43
  Top 0.152: 90.63,4.9 90.63,2.68
N$44
  Top 0.152: 90.31,4.64 88.68,4.13
N$45
  Top 0.152: 88.4,4.35 88.4,2.76 85.05,3.53
N$46
  Top 0.152: 88.38,4.94 88.38,9.86
PWM
  Bottom 0.152: R26.2 19.37,63.82 20.9,65.35 22.35,65.35 24.45,67.45 24.45,72.14 U1.13
RELAIS  (via drill 0.35)
  Top 0.152: v26.35,71.75 26.35,67.63 22.23,63.5 22.23,62.87 22.25,62.84 22.25,62.61 24.95,59.91 70.01,59.91 70.62,59.31 70.62,56.53 69.96,55.88 v64.45,55.88
  Bottom 0.152: Q5.1 64.28,56.05 v64.45,55.88 | U1.9 26.35,74.76 v26.35,71.75
RESET
  Bottom 0.152: C4.1 R13.1 | C4.1 5.94,68.38 5.94,67.2 6.74,66.4 9.25,66.4 10.7,67.85 10.7,69.6 S3.4 11.23,71.15 15.06,74.99 15.06,77.6 17.47,80.01 17.71,80.01 U1.29 | ISP.5 5.71,83.31 6.58,82.45 6.58,77.49 5.4,76.31 4.99,76.31 4.85,76.18 4.85,72.3 6.99,70.17 C4.1
RX
  Bottom 0.152: SERIAL.5 5.71,72.39 6.35,71.75 8.89,71.75 9.93,72.8 9.93,81.18 10.06,81.31 17.54,81.31 U1.30
S_1  (via drill 0.35)
  Top 0.152: v22.23,77.15 v22.23,75.25
  Bottom 0.152: S1.2 21.8,82.99 20.82,82.01 20.82,78.56 v22.23,77.15 | U1.12 22.35,75.37 v22.23,75.25
S_2
  Bottom 0.152: U1.14 23.81,71.64 23.81,68.69 S2.2
S_ENC
  Bottom 0.152: S_ENC.D 64.47,77.14 64.47,88.43 62.91,89.99 60.03,89.99 59.18,90.84 59.18,93.31 56.26,96.23 36.24,96.23 22.86,82.84 22.86,82.06 U1.1
SCK
  Bottom 0.152: U1.17 17.93,69.22 16.1,69.22 15.99,69.1 12.97,66.09 6.62,66.09 4.55,68.16 4.55,87.31 4.99,87.74 6.45,87.74 8.26,85.93 ISP.3
SCL
  Bottom 0.152: IC1.10 33.38,75.2 32.2,76.38 | 32.2,76.38 32.2,80.62 31.87,80.95 31.87,83.09 R14.1 32.6,85.6 37.48,90.47 51.1,90.47 51.91,91.28 OLED.SCL | U1.28 20.21,76.38 32.2,76.38
SDA
  Bottom 0.152: U1.27 19.38,76.08 32.07,76.08 32.88,75.26 IC1.9 33.03,74.36 33.03,73.91 33.16,73.78 33.6,73.78 33.74,73.91 33.74,80.46 R15.1 33.66,82.66 33.66,86.23 37.6,90.17 54.61,90.17 55.72,91.28 OLED.SDA
SENSE_A0
  Bottom 0.152: IC1.4 31.93,70.23 31.93,69.75 34.7,66.98 34.7,65.63 35.49,64.84 35.49,62.39 36.37,61.51 43.61,61.51 45.28,63.17 47.12,63.17 47.93,62.36 47.93,57.91 48.69,57.15 67.31,57.15 67.09,57.37 R1.2 67.4,57.47 69.94,60.01 73.34,60.01 73.66,59.69 IC2.7 IC2.2
SENSE_A1
  Bottom 0.152: R16.1 R17.2 32.38,64.35 32.38,67.31 D2.3 32.38,68.58 31.39,69.58 IC1.5
SENSE_A2
  Bottom 0.152: R2.1 R3.2 27.94,64.35 D4.3 27.94,70.9 27.65,71.19 27.65,73.59 28.07,74.02 30.9,74.02 IC1.6
TX
  Bottom 0.152: SERIAL.3 8.26,76.2 9.63,77.57 9.63,81.31 9.94,81.62 18.36,81.62 U1.31
UA  (via drill 0.35)
  Top 0.152: v42.23,55.24 40.61,56.86 27.57,56.86 21.92,62.52 21.92,63.63 25.72,67.42 v25.72,70.48
  Bottom 0.152: Q1.1 41.12,55.24 v42.23,55.24 | U1.11 25.4,73.45 25.4,70.8 v25.72,70.48
VBAT+  (via drill 0.35)
  Top 0.152: v20.8,75.25 14.61,81.44 14.61,85.72 16.51,87.63 29.84,87.63 38.1,95.89 73.66,95.89 v76.2,93.34
  Bottom 0.152: v20.8,75.25 20.8,74.34 U1.19 | 75.56,92.71 v76.2,93.34
  Bottom 0.406: IC3.5 68.52,83.82 | SW_PWR1.P$1 87,93.98 86.36,94.61 74.93,94.61 74.3,93.98 74.3,93.34 VBAT+.P$1 75.56,92.71 76.2,92.08 76.2,90.81 76.83,90.17 | 68.52,83.82 75.56,83.82 76.2,84.45 76.2,89.53 76.83,90.17 | 76.83,90.17 R10.2 | 68.52,83.82
VBAT-  (via drill 0.35)
  Top 0.152: v80.01,93.34 77.17,96.19 37.97,96.19 29.72,87.94 16.38,87.94 14.39,85.94 14.3,85.85 14.3,80.27 v19.32,75.25
  Bottom 0.152: U1.22 17.67,74.61 18.73,74.61 19.32,75.2 v19.32,75.25 | 79.38,92.71 v80.01,93.34
  Bottom 0.406: C8.1 77.25,87.21 77.47,87 81.92,87 82.23,87.31 IC4.6 82.23,88.58 81.92,88.9 | 81.92,88.9 80.01,90.81 80.01,92.08 79.38,92.71 VBAT-.P$1 | IC6.3 85.41,84.77 85.72,84.45 88.27,84.45 88.9,85.09 88.9,88.9 88.27,89.53 82.55,89.53 81.92,88.9
VUSB
  Bottom 0.152: LED_R.A 8.57,95.25 7.94,95.89 7.94,96.84 8.89,97.79 14.61,97.79 15.56,96.84 | LED_G.A 16.19,95.25 15.56,95.89 15.56,96.84 | VUSB+.P$1 60.71,93.6 60.71,94 56.94,97.77 16.48,97.77 15.56,96.84
  Bottom 0.406: 68.05,90.81 C9.2 | 68.05,90.81 68.05,89 67.94,88.9 IC3.8 68.9,88.9 69.53,88.27 69.53,86.68 71.12,85.09 IC3.4 | 68.05,90.81 67.77,91.08 64.29,91.08 62.67,92.71 VUSB+.P$1

### Text on the board
tPlace: Charging | IN+ | IN- | OUT- | OUT+ | Pwr-Meter | GND | LOAD | E-Load | designed by Jakob Faltisek
bPlace: LED_ON | V_USB | V_BAT | SW_PWR | MOSI | VCC | + | - | GND | VCC | SCL | SDA | + | - | + | - | GND | RST | SCK | MISO | VCC | GND | RX | TX | DTR | SW+ | B | A | C | SW- | RESET | V1.0 - 0818